# EAGLE design BR85_MKL_3309_Lichtplatine_vorne_V2 (EAGLE 5.10)
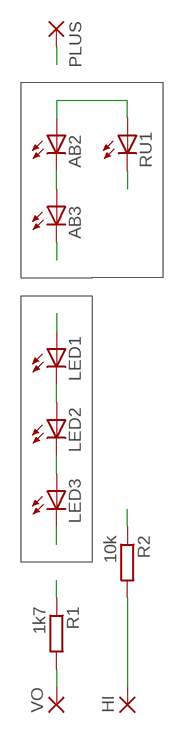
[diagram p0: schematic, sheet 1]

## Parts
AB2  LEDCHIP-LED0603  [CHIP-LED0603]
AB3  LEDCHIP-LED0603  [CHIP-LED0603]
HI  SMD2  [SMD1,27-2,54]
LED1  LEDCHIPLED_0603-JP  [CHIPLED-0603-JP]
LED2  LEDCHIPLED_0603-JP  [CHIPLED-0603-JP]
LED3  LEDCHIPLED_0603-JP  [CHIPLED-0603-JP]
PLUS  SMD2  [SMD1,27-2,54]
R1  1k7  R-EU_R0603  [R0603]
R2  10k  R-EU_R0603  [R0603]
RU1  LEDCHIP-LED0603  [CHIP-LED0603]
VO  SMD2  [SMD1,27-2,54]

## Nets
N$1: AB2.C AB3.A
N$2: R1.2 VO.1(P)
N$3: LED3.C
N$4: AB3.C
N$5: AB2.A RU1.A
N$6: HI.1(P) R2.2
N$10: PLUS.1(P)
N$13: RU1.C
N$14: LED1.A
N$15: R2.1
N$17: R1.1
N$19: LED1.C LED2.A
N$20: LED2.C LED3.A

## Library data of the parts
AB2 AB3 LED1-LED3 RU1 = led:LED: LED OSRAM: - CHIPLED LG R971, LG N971, LY N971, LG Q971, LY Q971, LO R971, LY R971 LH N974, LH R974 LS Q976, LO Q976, LY Q976 LO Q996 - Hyper CHIPLED LW Q18S LB Q993, LB Q99A, LB R99A - SideLED LS A670, LO A670, LY A670, LG A670, LP A670 LB A673, LV A673, LT A673, LW A673 LH A674 LY A675 LS A676, LA A676, LO A676, LY A676, LW A676 LS A679, LY A679, LG A679 - Hyper Micro SIDELED® LS Y876, LA Y876, LO Y876, LY Y876 LT Y87S - SmartLED LW L88C, LW L88S LB L89C, LB L89S, LG L890 LS L89K, LO L89K, LY L89K LS L896, LA L896, LO L896, LY L896 - TOPLED LS T670, LO T670, LY T670, LG T670, LP T670 LSG T670, LSP T670, LSY T670, LOP T670, LYG T670 LG T671, LOG T671, LSG T671 LB T673, LV T673, LT T673, LW T673 LH T674 LS T676, LA T676, LO T676, LY T676, LB T676, LH T676, LSB T676, LW T676 LB T67C, LV T67C, LT T67C, LS T67K, LO T67K, LY T67K, LW E67C LS E67B, LA E67B, LO E67B, LY E67B, LB E67C, LV E67C, LT E67C LW T67C LS T679, LY T679, LG T679 LS T770, LO T770, LY T770, LG T770, LP T770 LB T773, LV T773, LT T773, LW T773 LH T774 LS E675, LA E675, LY E675, LS T675 LS T776, LA T776, LO T776, LY T776, LB T776 LHGB T686 LT T68C, LB T68C - Hyper Mini TOPLED® LB M676 - Mini TOPLED Santana® LG M470 LS M47K, LO M47K, LY M47K Source: http://www.osram.convergy.de LUXEON: - LUMILED® LXK2-PW12-R00, LXK2-PW12-S00, LXK2-PW14-U00, LXK2-PW14-V00 LXK2-PM12-R00, LXK2-PM12-S00, LXK2-PM14-U00 LXK2-PE12-Q00, LXK2-PE12-R00, LXK2-PE12-S00, LXK2-PE14-T00, LXK2-PE14-U00 LXK2-PB12-K00, LXK2-PB12-L00, LXK2-PB12-M00, LXK2-PB14-N00, LXK2-PB14-P00, LXK2-PB14-Q00 LXK2-PR12-L00, LXK2-PR12-M00, LXK2-PR14-Q00, LXK2-PR14-R00 LXK2-PD12-Q00, LXK2-PD12-R00, LXK2-PD12-S00 LXK2-PH12-R00, LXK2-PH12-S00 LXK2-PL12-P00, LXK2-PL12-Q00, LXK2-PL12-R00 Source: www.luxeon.com KINGBRIGHT: KA-3528ASYC Source: www.kingbright.com
HI PLUS VO = wirepad:SMD2: SMD PAD
R1 R2 = rcl:R-EU_: RESISTOR, European symbol

## Board
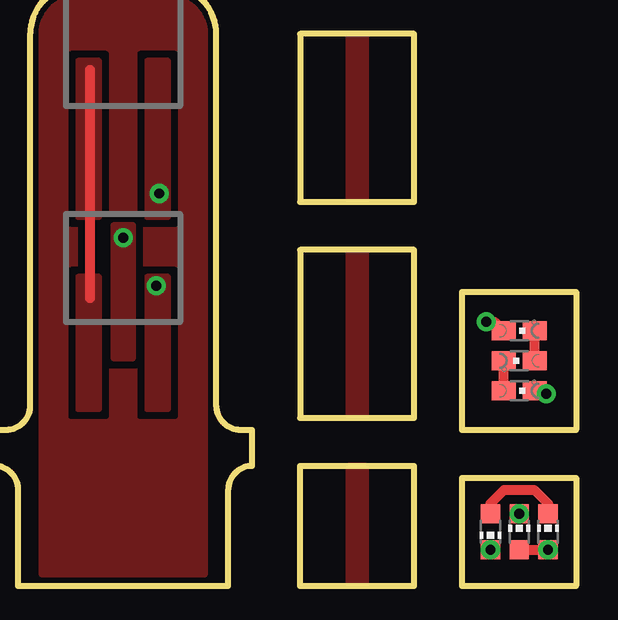
[diagram p1: board, top side]
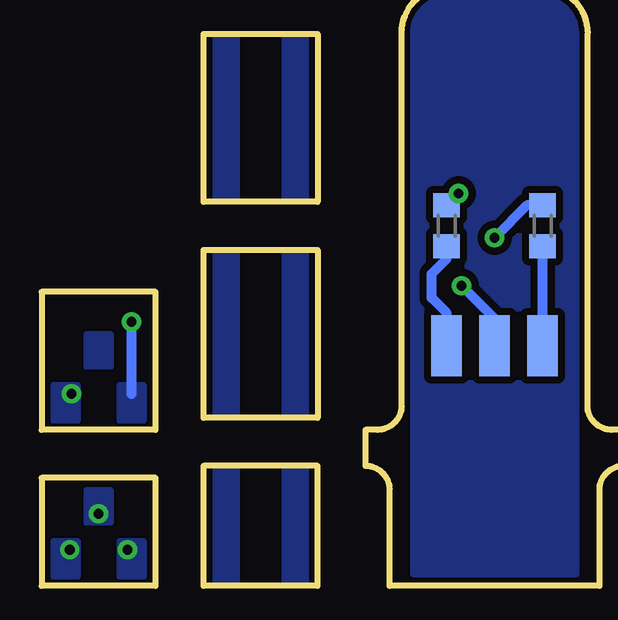
[diagram p2: board, bottom side, seen from below]

No outline drawn. Coordinates in mm, seen from the top.
Copper layers (1*16): Top 0.035mm / dielectric 1.5mm / Bottom 0.035mm
Design rules "default *": minimum track width 7mil, minimum drill 0.4mm, track to track 8mil, track to pad 8mil, pad to pad 8mil, via to via 8mil, smd to smd 8mil, copper to edge 40mil, drill to drill 8mil, minimum pad ring 10mil, minimum via ring 8mil, stop-mask expansion 4mil, vias tented up to drill 0mil, thermal gap 10mil
Milling: 36 lines

### Footprints (pad centres in the part's own frame; a part is rotated, then mirrored left to right if it is on the bottom)
CHIP-LED0603 = smd 0.8 x 0.8: A 0,-0.75; C 0,0.75
SMD1,27-2,54 = smd 1.27 x 2.54: 1 0,0
CHIPLED-0603-JP = smd 0.8 x 1: A 0,-0.65; C 0,0.65
R0603 = smd 1 x 1.1: 1 -0.85,0; 2 0.85,0

### Placement (x,y rotation side)
AB2  23.07,2.25 0 top
AB3  20.68,2.25 180 top
HI  3.38,10 180 bottom
LED1  21.88,10.62 270 top
LED2  21.88,9.38 90 top
LED3  21.88,8.12 270 top
PLUS  5.38,10 180 bottom
R1  7.38,15 270 bottom
R2  3.38,15 270 bottom
RU1  21.88,2.25 0 top
VO  7.38,10 180 bottom

### Tracks (layer width: path | path; a pad name or v marks a point on that pad's centre or on a via)
N$1
  Top 0.406: AB2.C 23.07,3.42 22.5,4 21.25,4 20.68,3.42 AB3.A
N$2
  Bottom 0.406: VO.1 7.38,11.38 8,12 8,13 7.38,13.62 R1.2
N$3  (via drill 0.4)
  Top 0.406: LED3.C 22.82,8.12 v23,8
  pour Bottom (isolate 0.305): 22.75,8.38 22.75,6.88 23.75,6.88 23.75,8.38
N$4  (via drill 0.4)
  other vias: 20.68,1.5
  pour Bottom (isolate 0.305): 20,1.88 20,0.38 21,0.38 21,1.88
N$5  (via drill 0.4)
  Top 0.406: RU1.A AB2.A
  other vias: 23.07,1.5
  pour Bottom (isolate 0.305): 22.75,1.88 22.75,0.38 23.75,0.38 23.75,1.88
N$6
  Bottom 0.406: HI.1 R2.2
N$7
  pour Bottom (isolate 0.305, rank 3): 2,0.5 2,23 arc-90 3.5,24.5 7.25,24.5 arc-90 8.75,23 8.75,0.5
  pour Top (isolate 0.305, rank 3): 2,0.5 2,23 arc-90 3.5,24.5 7.25,24.5 arc-90 8.75,23 8.75,0.5
N$8
  pour Bottom (isolate 0.305): 13.25,23 13.25,16 14.12,16 14.12,23
N$9
  pour Top (isolate 0.305): 14.75,23 14.75,16 15.5,16 15.5,23
N$10  (via drill 0.4)
  Bottom 0.406: PLUS.1 5.38,11.12 v6.75,12.5
  pour Top (isolate 0.305): 6.38,12.88 6.38,7.38 7.25,7.38 7.25,12.88
N$11
  pour Bottom (isolate 0.305): 16.12,23 16.12,16 17,16 17,23
N$13  (via drill 0.4)
  other vias: 21.88,3
  pour Bottom (isolate 0.305): 21.38,4 21.38,2.62 22.38,2.62 22.38,4
N$14  (via drill 0.4)
  Top 0.406: v20.5,11 20.85,11 LED1.A
  Bottom 0.406: 20.5,8 v20.5,11
  pour Bottom (isolate 0.305): 20,8.38 20,6.88 21,6.88 21,8.38
N$15  (via drill 0.4)
  Bottom 0.406: R2.1 4.03,15.85 v5.38,14.5
  pour Top (isolate 0.305, rank 2): 5,15 5,9.5 5.75,9.5 5.75,15
N$16
  pour Bottom (isolate 0.305): 21.38,10.5 21.38,9.12 22.38,9.12 22.38,10.5
N$17  (via drill 0.4)
  Bottom 0.406: R1.1 v6.88,16.35
  pour Top (isolate 0.305): 6.38,21.88 6.38,15.38 7.25,15.38 7.25,21.88
N$19
  Top 0.406: LED2.A LED1.C
N$20
  Top 0.406: LED3.A LED2.C
N$99
  Top 0.406: 4,12 4,21.5
  pour Top (isolate 0.305): 3.5,12.88 3.5,7.38 4.38,7.38 4.38,12.88
  pour Top (isolate 0.305): 3.5,21.88 3.5,15.38 4.38,15.38 4.38,21.88
N$101
  pour Bottom (isolate 0.305): 13.25,5 13.25,0 14.12,0 14.12,5
N$102
  pour Top (isolate 0.305): 14.75,5 14.75,0 15.5,0 15.5,5
N$103
  pour Bottom (isolate 0.305): 16.12,5 16.12,0 17,0 17,5
N$201
  pour Bottom (isolate 0.305): 13.25,14 13.25,7 14.12,7 14.12,14
N$202
  pour Top (isolate 0.305): 14.75,14 14.75,7 15.5,7 15.5,14
N$203
  pour Bottom (isolate 0.305): 16.12,14 16.12,7 17,7 17,14

### Text on the board
tStop: BR85 LED | Märklin 3309 | design by Janik Merz
bStop: BR85 LED | rt | + | ws
Measures: Dicke = 1mm